# EasyEDA schematic 1-Schematic_relay_module.json
TITLE: Sheet_1; REV: 1.0; Date: 2023-05-24; Sheet: 1/1; Drawn By: rf3mechanic; Company: Your Company
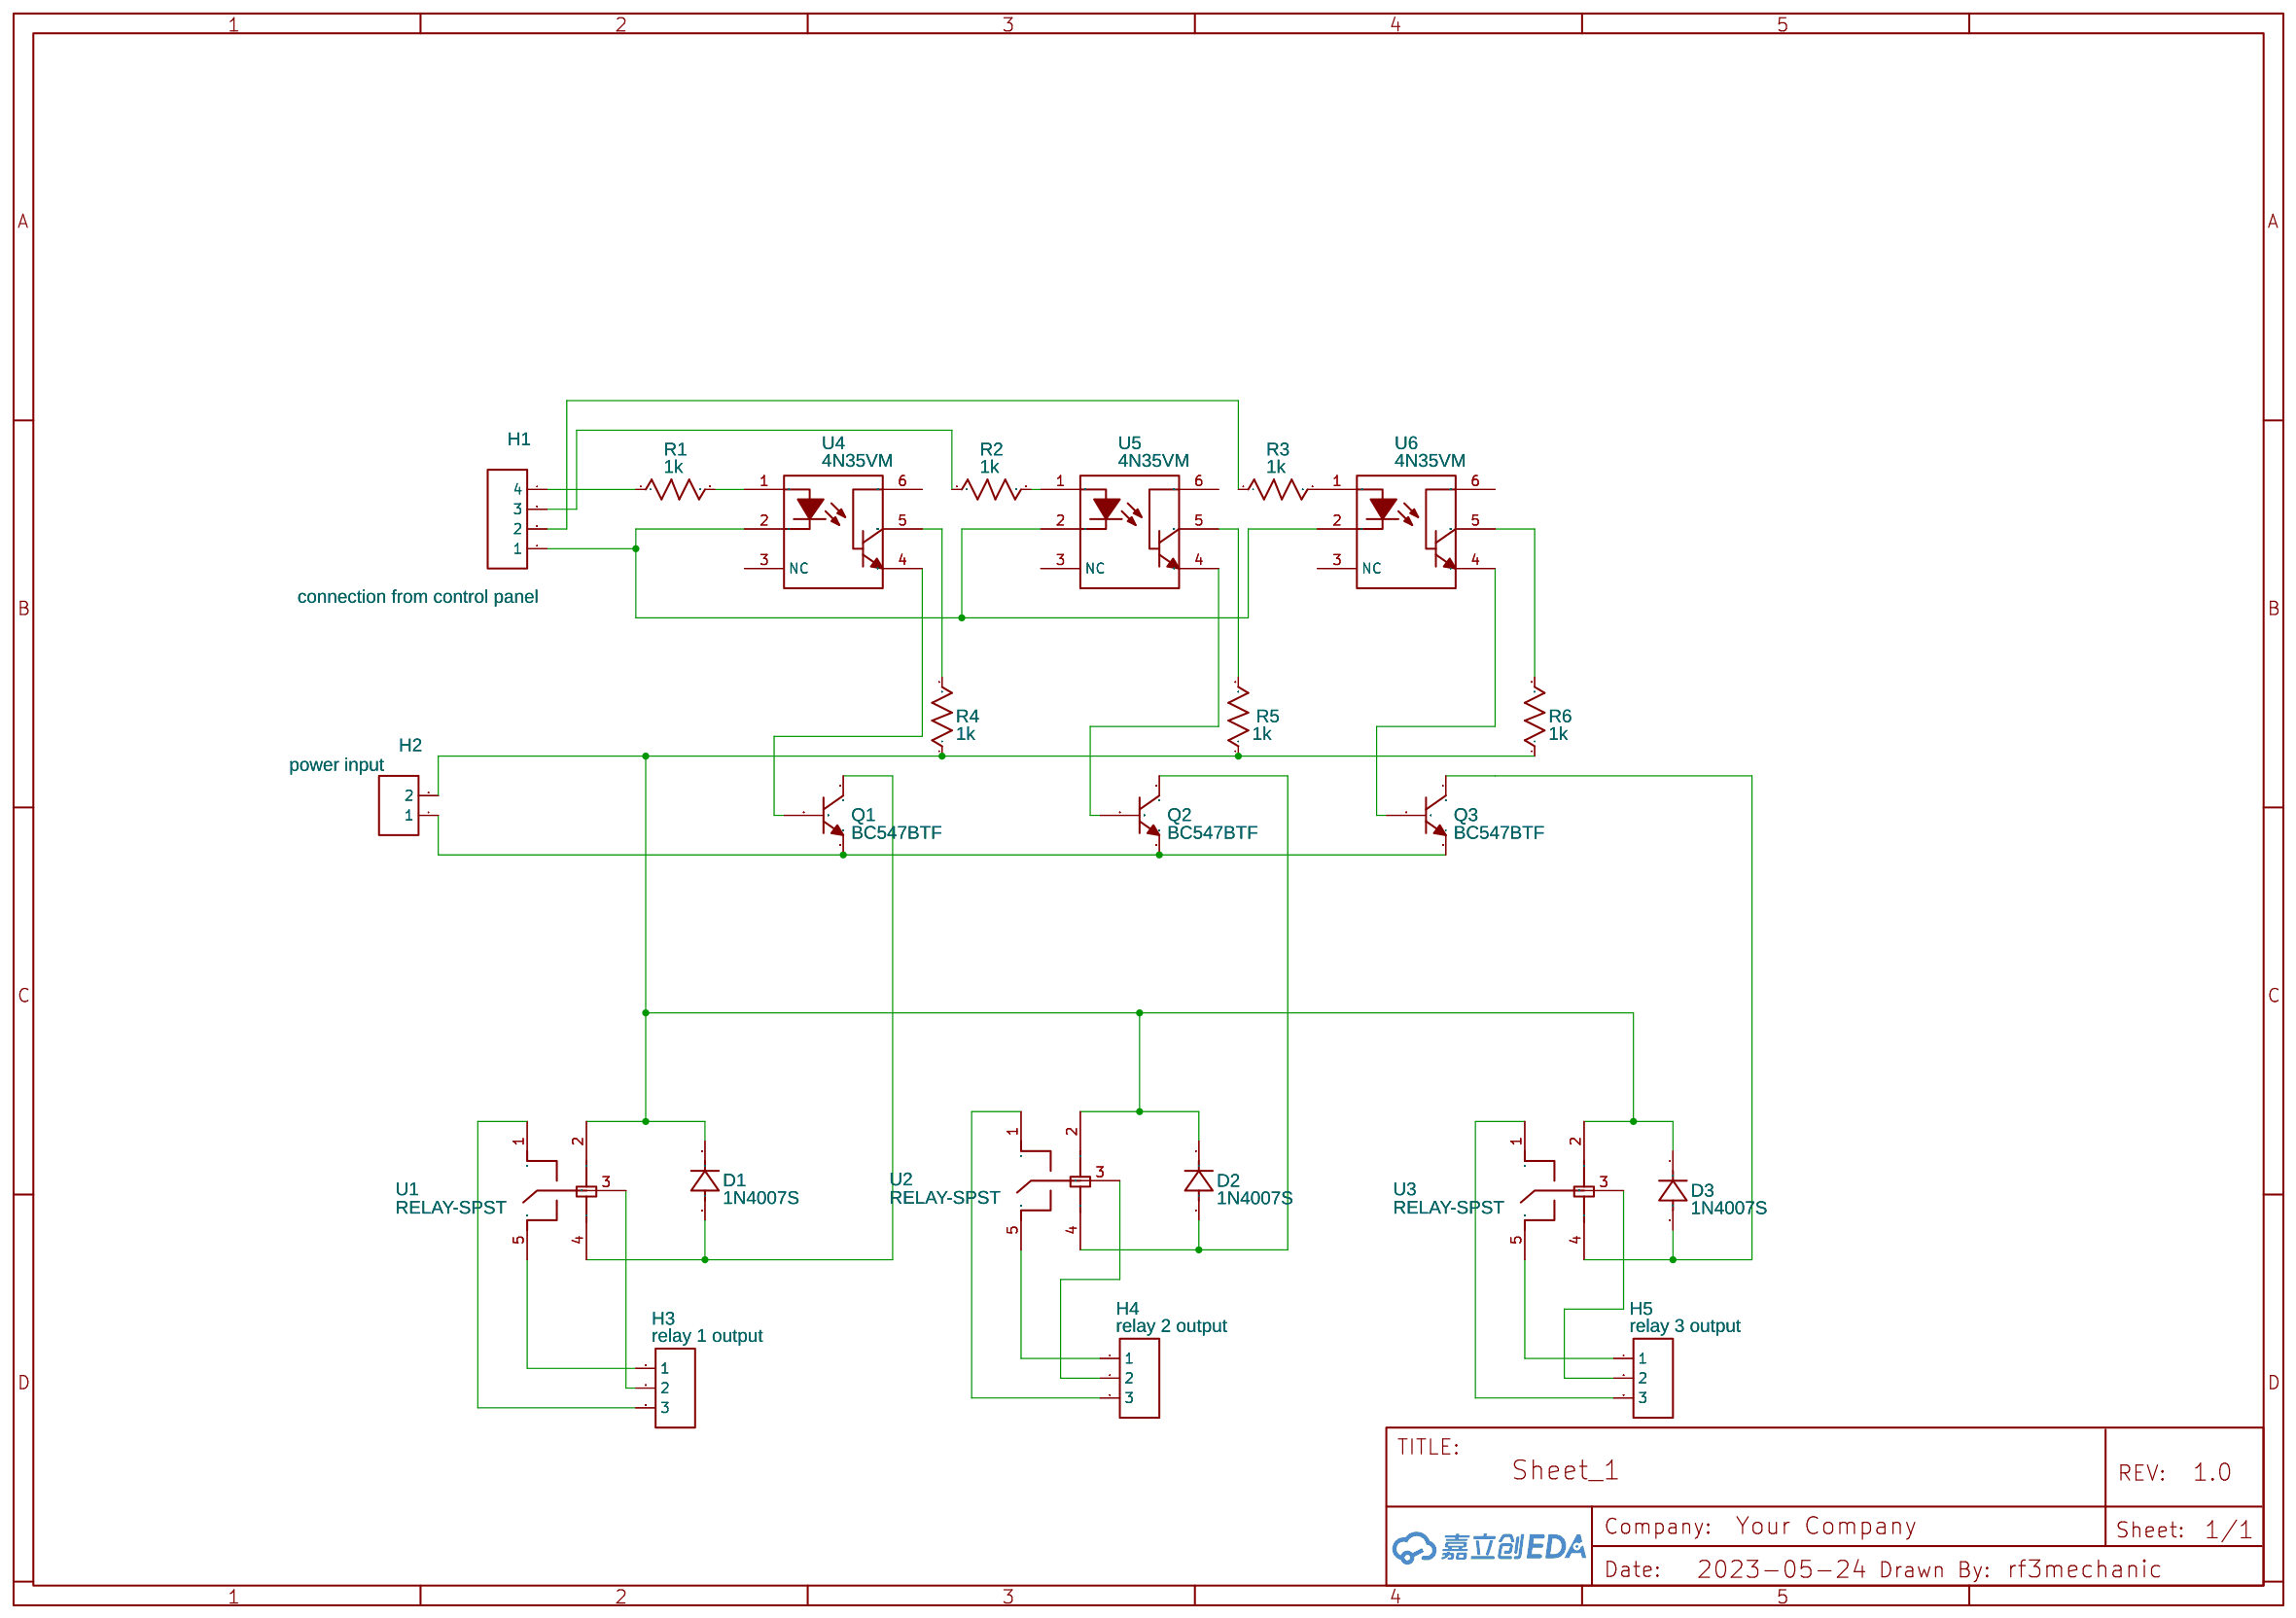
[diagram p0: schematic sheet]

## Parts
D1  1N4007S  [DO-41_BD2.4-L4.7-P8.70-D0.6-RD]
D2  1N4007S  [DO-41_BD2.4-L4.7-P8.70-D0.6-RD]
D3  1N4007S  [DO-41_BD2.4-L4.7-P8.70-D0.6-RD]
H1  connection from control panel  [HDR-F-2.54_1X4]
H2  power input  [HDR-F-2.54_1X2]
H3  relay 1 output  [HDR-F-2.54_1X3]
H4  relay 2 output  [HDR-F-2.54_1X3]
H5  relay 3 output  [HDR-F-2.54_1X3]
Q1  BC547BTF  [TO-92-3_L4.9-W3.7-P2.54-L]
Q2  BC547BTF  [TO-92-3_L4.9-W3.7-P2.54-L]
Q3  BC547BTF  [TO-92-3_L4.9-W3.7-P2.54-L]
R1  1k  [R_AXIAL-0.4]
R2  1k  [R_AXIAL-0.4]
R3  1k  [R_AXIAL-0.4]
R4  1k  [R_AXIAL-0.4]
R5  1k  [R_AXIAL-0.4]
R6  1k  [R_AXIAL-0.4]
U1  RELAY-SPST  [RELAY-TH_RELAY-SPST]
U2  RELAY-SPST  [RELAY-TH_RELAY-SPST]
U3  RELAY-SPST  [RELAY-TH_RELAY-SPST]
U4  4N35VM  [SMD-6_L8.6-W6.4-P2.54-LS9.6-BL]
U5  4N35VM  [SMD-6_L8.6-W6.4-P2.54-LS9.6-BL]
U6  4N35VM  [SMD-6_L8.6-W6.4-P2.54-LS9.6-BL]

## Library data of the parts
D1-D3 = 1N4007S: Supplier: LCSC; Supplier Part: C2992088; Manufacturer: 星海; Contributor: lcsc
H1 = HDR-F-2.54_1x4: Supplier Part: C225501; Supplier: LCSC; Contributor: LCEDA_Lib
H2 = HDR-F-2.54_1x2: Supplier Part: C49661; Supplier: LCSC; Contributor: LCEDA_Lib
H3-H5 = HDR-F-2.54_1x3: Supplier Part: C146690; Supplier: LCSC; Contributor: LCEDA_Lib
Q1-Q3 = BC547BTF: Supplier: LCSC; Supplier Part: C900798; Manufacturer: onsemi(安森美); Contributor: LCSC; JLCPCB Part Class: Extended Part
R1-R6 = R_AXIAL-0.4_US: Contributor: LCEDA_Lib
U1-U3 = RELAY-SPST: Supplier: LCSC; Supplier Part: C2941249; Manufacturer: null; Manufacturer Part: Relay-SPST; JLCPCB Part Class: Extended Part; Contributor: LCSC
U4-U6 = 4N35VM: Supplier: LCSC; Supplier Part: C898968; Manufacturer: onsemi(安森美); Contributor: LCSC; JLCPCB Part Class: Extended Part

## Nets
Net-(D1-1): D1.1(K) D2.1(K) D3.1(K) H2.2 R4.1 R5.1 R6.1 U1.2 U2.2 U3.2
Net-(D1-2): D1.2(A) Q1.1(C) U1.4
Net-(D2-2): D2.2(A) Q2.1(C) U2.4
Net-(D3-2): D3.2(A) Q3.1(C) U3.4
Net-(H1-1): H1.1 U4.2(CAT) U5.2(CAT) U6.2(CAT)
Net-(H1-2): H1.2 R3.1
Net-(H1-3): H1.3 R2.1
Net-(H1-4): H1.4 R1.1
Net-(H2-1): H2.1 Q1.3(E) Q2.3(E) Q3.3(E)
Net-(H3-1): H3.1 U1.5
Net-(H3-2): H3.2 U1.3
Net-(H3-3): H3.3 U1.1
Net-(H4-1): H4.1 U2.5
Net-(H4-2): H4.2 U2.3
Net-(H4-3): H4.3 U2.1
Net-(H5-1): H5.1 U3.5
Net-(H5-2): H5.2 U3.3
Net-(H5-3): H5.3 U3.1
Net-(Q1-2): Q1.2(B) U4.4(EMI)
Net-(Q2-2): Q2.2(B) U5.4(EMI)
Net-(Q3-2): Q3.2(B) U6.4(EMI)
Net-(R1-2): R1.2 U4.1(ANO)
Net-(R2-2): R2.2 U5.1(ANO)
Net-(R3-2): R3.2 U6.1(ANO)
Net-(R4-2): R4.2 U4.5(COL)
Net-(R5-2): R5.2 U5.5(COL)
Net-(R6-2): R6.2 U6.5(COL)

Not connected (* = marked no-connect by the designer): U4 3(NC) 6(BAS); U5 3(NC) 6(BAS); U6 3(NC) 6(BAS)
